# Altium schematic sheet MB-08-Mot-Two_phase.SchDoc
size A4
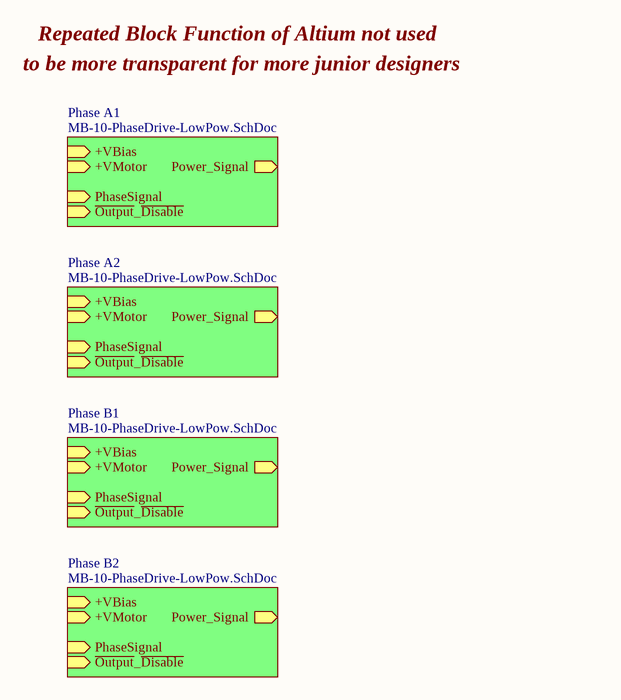
[diagram p0: MB-08-Mot-Two_phase.SchDoc]

## Sub-sheets
Phase A1 = MB-10-PhaseDrive-LowPow.SchDoc: PhaseSignal (in), ~{Output}_~{Disable} (in), +VMotor (in), +VBias (in), Power_Signal (out)
Phase A2 = MB-10-PhaseDrive-LowPow.SchDoc: PhaseSignal (in), ~{Output}_~{Disable} (in), +VMotor (in), +VBias (in), Power_Signal (out)
Phase B1 = MB-10-PhaseDrive-LowPow.SchDoc: PhaseSignal (in), ~{Output}_~{Disable} (in), +VMotor (in), +VBias (in), Power_Signal (out)
Phase B2 = MB-10-PhaseDrive-LowPow.SchDoc: PhaseSignal (in), ~{Output}_~{Disable} (in), +VMotor (in), +VBias (in), Power_Signal (out)

## Notes on the sheet
- to be more transparent for more junior designers
- Repeated Block Function of Altium not used